# EAGLE design piTC4_v1 (EAGLE 9.6.2)
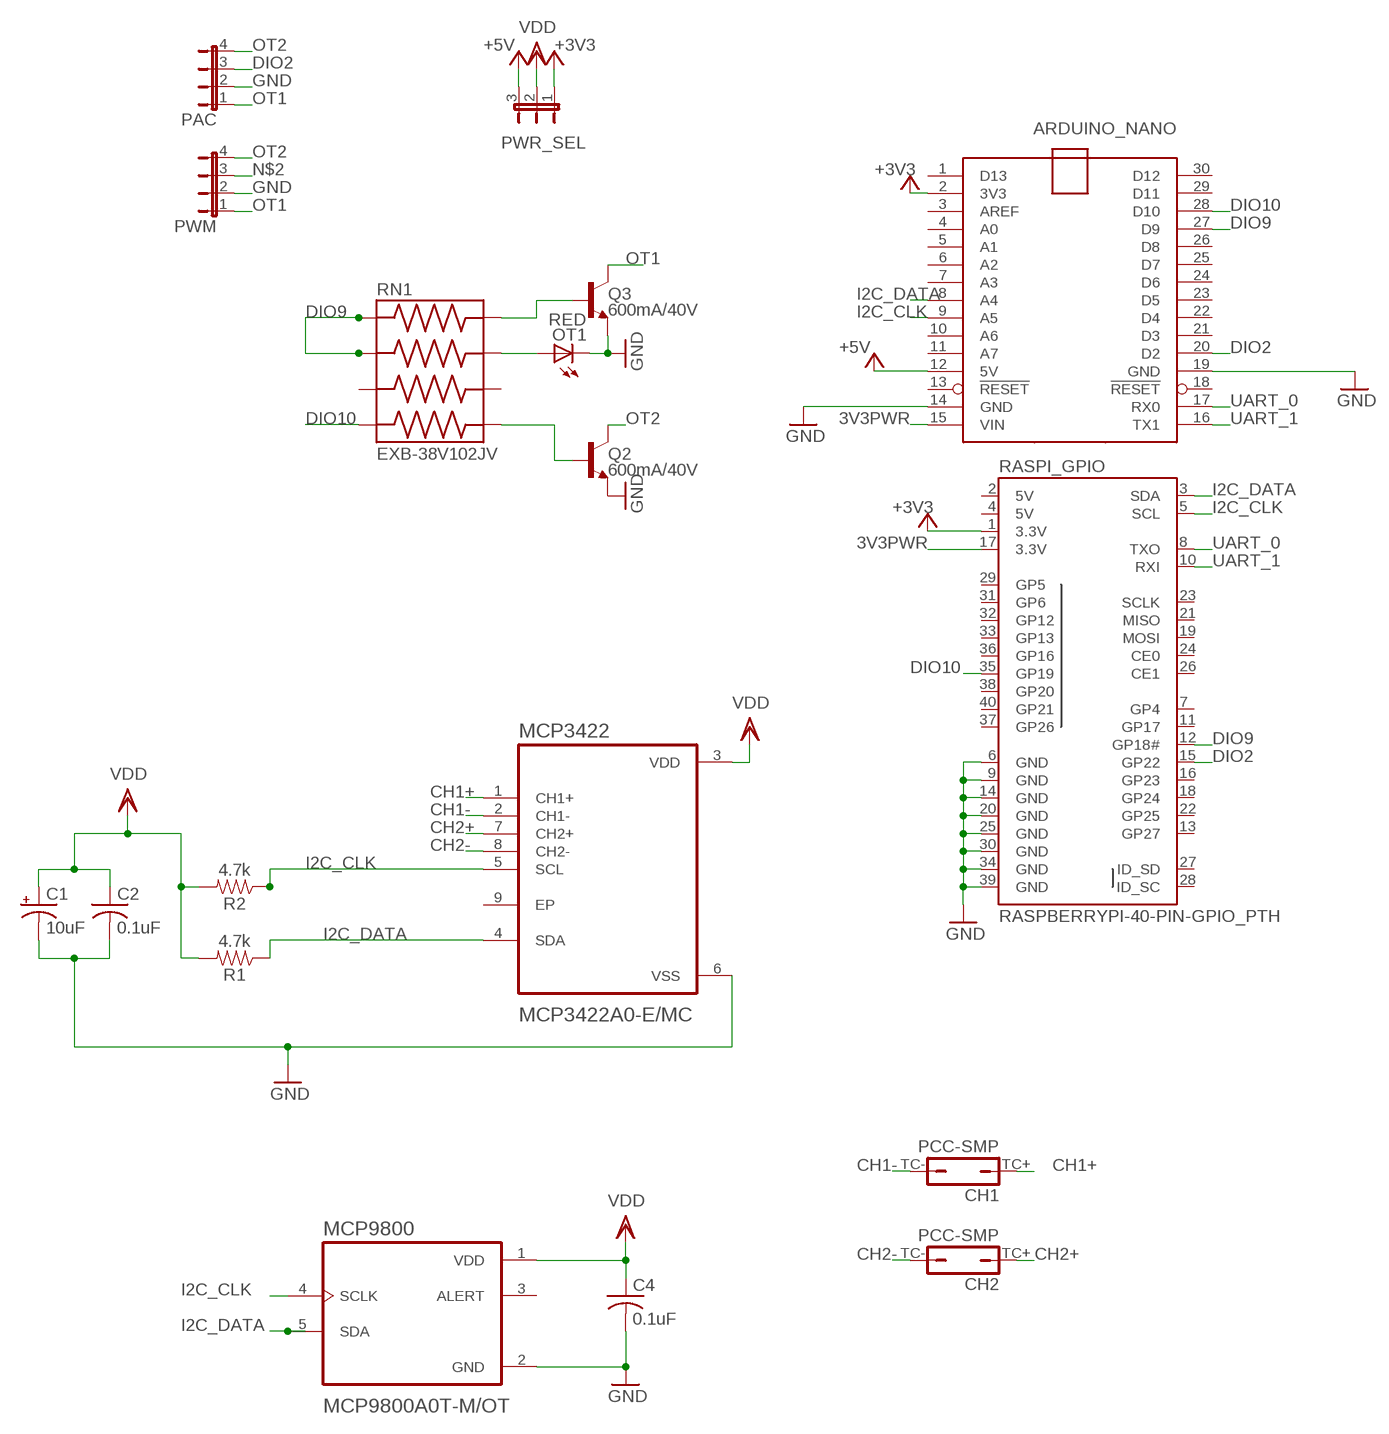
[diagram p0: schematic, sheet 1]

## Parts
ARDUINO_NANO  ARDUINO_NANO  [ARDUINO_NANO]
C1  10uF  10UF-POLAR-EIA3216-16V-10%(TANT)  [EIA3216]
C2  0.1uF  C-USC0805  [C0805]
C4  0.1uF  C-USC0805  [C0805]
CH1  PCC-SMP  [PCC-SMP]
CH2  PCC-SMP  [PCC-SMP]
MCP3422  MCP3422A0-E/MC  [SON50P200X300X100-9N]
MCP9800  MCP9800A0T-M/OT  [SOT95P270X145-5N]
OT1  RED  LEDCHIPLED_0805  [CHIPLED_0805]
PAC  JP4E  [JP4]
PWM  JP4E  [JP4]
PWR_SEL  JP2E  [JP2]
Q2  600mA/40V  TRANS_NPN-MMBT2222AL  [SOT23-3]
Q3  600mA/40V  TRANS_NPN-MMBT2222AL  [SOT23-3]
R1  4.7k  4.7KOHM-0603-1/10W-1%  [0603]
R2  4.7k  4.7KOHM-0603-1/10W-1%  [0603]
RASPI_GPIO  RASPBERRYPI-40-PIN-GPIO_PTH  [2X20_SHROUDED]
RN1  EXB-38V102JV  [RESCAXS80P320X160X60-8N]

## Nets
3V3PWR: ARDUINO_NANO.15(VIN) RASPI_GPIO.17(3.3V)
+3V3: ARDUINO_NANO.2(3V3) PWR_SEL.1 RASPI_GPIO.1(3.3V)
+5V: ARDUINO_NANO.12(5V) PWR_SEL.3
CH1+: CH1.TC+ MCP3422.1(CH1+)
CH1-: CH1.TC- MCP3422.2(CH1-)
CH2+: CH2.TC+ MCP3422.7(CH2+)
CH2-: CH2.TC- MCP3422.8(CH2-)
DIO2: ARDUINO_NANO.20(D2) PAC.3 RASPI_GPIO.15(GP22)
DIO9: ARDUINO_NANO.27(D9) RASPI_GPIO.12(GP18#) RN1.1 RN1.2
DIO10: ARDUINO_NANO.28(D10) RASPI_GPIO.35(GP19) RN1.4
GND: ARDUINO_NANO.14(GND) ARDUINO_NANO.19(GND) C1.- C2.2 C4.2 MCP3422.6(VSS) MCP9800.2(GND) OT1.C PAC.2 PWM.2 Q2.2(E) Q3.2(E) RASPI_GPIO.6(GND) RASPI_GPIO.9(GND) RASPI_GPIO.14(GND) RASPI_GPIO.20(GND) RASPI_GPIO.25(GND) RASPI_GPIO.30(GND) RASPI_GPIO.34(GND) RASPI_GPIO.39(GND)
I2C_CLK: ARDUINO_NANO.9(A5) MCP3422.5(SCL) MCP9800.4(SCLK) R2.1 RASPI_GPIO.5(SCL)
I2C_DATA: ARDUINO_NANO.8(A4) MCP3422.4(SDA) MCP9800.5(SDA) R1.1 RASPI_GPIO.3(SDA)
N$1: Q2.1(B) RN1.5
N$2: PWM.3
N$5: Q3.1(B) RN1.8
N$6: OT1.A RN1.7
OT1: PAC.1 PWM.1 Q3.3(C)
OT2: PAC.4 PWM.4 Q2.3(C)
UART_0: ARDUINO_NANO.17(RX0) RASPI_GPIO.8(TXO)
UART_1: ARDUINO_NANO.16(TX1) RASPI_GPIO.10(RXI)
VDD: C1.+ C2.1 C4.1 MCP3422.3(VDD) MCP9800.1(VDD) PWR_SEL.2 R1.2 R2.2
Unconnected: ARDUINO_NANO.1(D13) ARDUINO_NANO.3(AREF) ARDUINO_NANO.4(A0) ARDUINO_NANO.5(A1) ARDUINO_NANO.6(A2) ARDUINO_NANO.7(A3) ARDUINO_NANO.10(A6) ARDUINO_NANO.11(A7) ARDUINO_NANO.13(!RESET) ARDUINO_NANO.18(!RESET) ARDUINO_NANO.21(D3) ARDUINO_NANO.22(D4) ARDUINO_NANO.23(D5) ARDUINO_NANO.24(D6) ARDUINO_NANO.25(D7) ARDUINO_NANO.26(D8) ARDUINO_NANO.29(D11) ARDUINO_NANO.30(D12) MCP3422.9(EP) MCP9800.3(ALERT) RASPI_GPIO.7(GP4) RASPI_GPIO.11(GP17) RASPI_GPIO.13(GP27) RASPI_GPIO.16(GP23) RASPI_GPIO.18(GP24) RASPI_GPIO.19(MOSI) RASPI_GPIO.21(MISO) RASPI_GPIO.22(GP25) RASPI_GPIO.23(SCLK) RASPI_GPIO.24(CE0) RASPI_GPIO.26(CE1) RASPI_GPIO.27(ID_SD) RASPI_GPIO.28(ID_SC) RASPI_GPIO.29(GP5) RASPI_GPIO.31(GP6) RASPI_GPIO.32(GP12) RASPI_GPIO.33(GP13) RASPI_GPIO.36(GP16) RASPI_GPIO.37(GP26) RASPI_GPIO.38(GP20) RASPI_GPIO.40(GP21) RN1.3 RN1.6

## Power pins joined to a net without a drawn wire
5V: RASPI_GPIO.2(5V) RASPI_GPIO.4(5V)

## Library data of the parts
ARDUINO_NANO = ArduinoNanoV30:ARDUINO_NANO: Arduino Nano V3.0 Overview: The Arduino Nano is a small, complete, and breadboard-friendly board based on the ATmega328 (Arduino Nano 3.x) or ATmega168 (Arduino Nano 2.x). It has more or less the same functionality of the Arduino Duemilanove, but in a different package. It lacks only a DC power jack, and works with a Mini-B USB cable instead of a standard one. The Nano was designed and is being produced by Gravitech. Specifications: Microcontroller Atmel ATmega168 or ATmega328 Operating Voltage (logic level) 5 V Input Voltage (recommended) 7-12 V Input Voltage (limits) 6-20 V Digital I/O Pins 14 (of which 6 provide PWM output) Analog Input Pins 8 DC Current per I/O Pin 40 mA Flash Memory 16 KB (ATmega168) or 32 KB (ATmega328) of which 2 KB used by bootloader SRAM 1 KB (ATmega168) or 2 KB (ATmega328) EEPROM 512 bytes (ATmega168) or 1 KB (ATmega328) Clock Speed 16 MHz Dimensions 0.73" x 1.70" Length 45 mm Width 18 mm Weigth 5 g Power: The Arduino Nano can be powered via the Mini-B USB connection, 6-20V unregulated external power supply (pin 30), or 5V regulated external power supply (pin 27). The power source is automatically selected to the highest voltage source. Memory: The ATmega168 has 16 KB of flash memory for storing code (of which 2 KB is used for the bootloader); the ATmega328 has 32 KB, (also with 2 KB used for the bootloader). The ATmega168 has 1 KB of SRAM and 512 bytes of EEPROM (which can be read and written with the EEPROM library); the ATmega328 has 2 KB of SRAM and 1 KB of EEPROM. Input and Output: Each of the 14 digital pins on the Nano can be used as an input or output, using pinMode(), digitalWrite(), and digitalRead() functions. They operate at 5 volts. Each pin can provide or receive a maximum of 40 mA and has an internal pull-up resistor (disconnected by default) of 20-50 kOhms. In addition, some pins have specialized functions. Visit Arduino - ArduinoBoardNano <https://www.arduino.cc/en/Main/ArduinoBoardNano>
C1 = SparkFun-Capacitors:10UF-POLAR: 10.0µF polarized capacitors A capacitor is a passive two-terminal electrical component used to store electrical energy temporarily in an electric field.; PROD_ID: CAP-00811
C2 C4 = adafruit:C-US: CAPACITOR, American symbol
CH1 CH2 = PCC-SMP:PCC-SMP
MCP3422 = MCP3422A0-E_MC:MCP3422A0-E/MC; DESCRIPTION: 18 Bit Analog to Digital Converter 2 Input 1 Sigma-Delta 8-DFN (2x3); DIGI-KEY_PART_NUMBER: MCP3422A0-E/MC-ND; MF: Microchip; MP: MCP3422A0-E/MC; PACKAGE: DFN-8 Microchip; PURCHASE-URL: https://pricing.snapeda.com/search/part/MCP3422A0-E/MC/?ref=eda
MCP9800 = MCP9800A0T-M_OT:MCP9800A0T-M/OT; DESCRIPTION: Temperature Sensor Digital, Local -55°C ~ 125°C 11 b SOT-23-5; DIGI-KEY_PART_NUMBER: MCP9800A0T-M/OTCT-ND; MF: Microchip; MP: MCP9800A0T-M/OT; PACKAGE: SOT-23-5 Microchip; PURCHASE-URL: https://pricing.snapeda.com/search/part/MCP9800A0T-M/OT/?ref=eda
OT1 = adafruit:LED: LED OSRAM: - CHIPLED LG R971, LG N971, LY N971, LG Q971, LY Q971, LO R971, LY R971 LH N974, LH R974 LS Q976, LO Q976, LY Q976 LO Q996 - Hyper CHIPLED LW Q18S LB Q993, LB Q99A, LB R99A - SideLED LS A670, LO A670, LY A670, LG A670, LP A670 LB A673, LV A673, LT A673, LW A673 LH A674 LY A675 LS A676, LA A676, LO A676, LY A676, LW A676 LS A679, LY A679, LG A679 - Hyper Micro SIDELED® LS Y876, LA Y876, LO Y876, LY Y876 LT Y87S - SmartLED LW L88C, LW L88S LB L89C, LB L89S, LG L890 LS L89K, LO L89K, LY L89K LS L896, LA L896, LO L896, LY L896 - TOPLED LS T670, LO T670, LY T670, LG T670, LP T670 LSG T670, LSP T670, LSY T670, LOP T670, LYG T670 LG T671, LOG T671, LSG T671 LB T673, LV T673, LT T673, LW T673 LH T674 LS T676, LA T676, LO T676, LY T676, LB T676, LH T676, LSB T676, LW T676 LB T67C, LV T67C, LT T67C, LS T67K, LO T67K, LY T67K, LW E67C LS E67B, LA E67B, LO E67B, LY E67B, LB E67C, LV E67C, LT E67C LW T67C LS T679, LY T679, LG T679 LS T770, LO T770, LY T770, LG T770, LP T770 LB T773, LV T773, LT T773, LW T773 LH T774 LS E675, LA E675, LY E675, LS T675 LS T776, LA T776, LO T776, LY T776, LB T776 LHGB T686 LT T68C, LB T68C - Hyper Mini TOPLED® LB M676 - Mini TOPLED Santana® LG M470 LS M47K, LO M47K, LY M47K Source: http://www.osram.convergy.de/
PAC PWM = jumper-piTC2:JP4E: JUMPER
PWR_SEL = jumper-piTC:JP2E: JUMPER
Q2 Q3 = SparkFun-DiscreteSemi:TRANS_NPN: NPN transistor Current controlled devices typically used to amplify current or used as a switch. BC547 - COM-08928 <http://www.sparkfun.com/products/8928> (TO-92 45V 100mA) (1.Collector 2.Base 3.Emitter) 2N3904 - COM-00521 <http://www.sparkfun.com/products/521> (TO-92 40V 200mA) (1.Emitter 2.Base 3.Collector) P2N2222A - COM-12852 <http://www.sparkfun.com/products/12852> (TO-92 40V 600mA) (1.Collector 2.Base 3.Emitter); PROD_ID: TRANS-08049
R1 R2 = SparkFun-Resistors:4.7KOHM: 4.7kΩ resistor A resistor is a passive two-terminal electrical component that implements electrical resistance as a circuit element. Resistors act to reduce current flow, and, at the same time, act to lower voltage levels within circuits. - Wikipedia; PROD_ID: RES-07857
RASPI_GPIO = SparkFun-Connectors:RASPBERRYPI-40-PIN-GPIO: Raspberry Pi GPIO Header 2x20 pin connector, as found on B, B+, A+ models. Both shrouded PTH and SMT versions available. SparkFun Products: GPIO Shrouded Header <https://www.sparkfun.com/products/13054>- PTH SparkFun Pi Wedge (Preassembled) <https://www.sparkfun.com/products/13717>; PROD_ID: CONN-12263; SF_ID: PRT-13054
RN1 = EXB-38V102JV:EXB-38V102JV: Res Thick Film Array 470 Ohm 5% ?200ppm/C ISOL Molded 8-Pin 1206(4 X 0603) Convex SMD Automotive T/R; DESCRIPTION: 1k Ohm ±5% 62.5mW Power Per Element Isolated Resistor Network/Array ±200ppm/°C 1206 (3216 Metric), Convex, Long Side Terminals; DIGI-KEY_PART_NUMBER: Y9102CT-ND; MF: Panasonic; MP: EXB-38V102JV; PACKAGE: 1206 Panasonic; PURCHASE-URL: https://pricing.snapeda.com/search/part/EXB-38V102JV/?ref=eda

## Net classes
0 default: width 0.305 mm, drill 0.127 mm, clearance 0.203 mm
1 DC: width 0.61 mm, drill 0.254 mm, clearance 0.406 mm
2 AC: width 5.08 mm, drill 0.305 mm, clearance 5.08 mm
3 Hole: drill 2.05 mm, clearance 4.8 mm

## Board
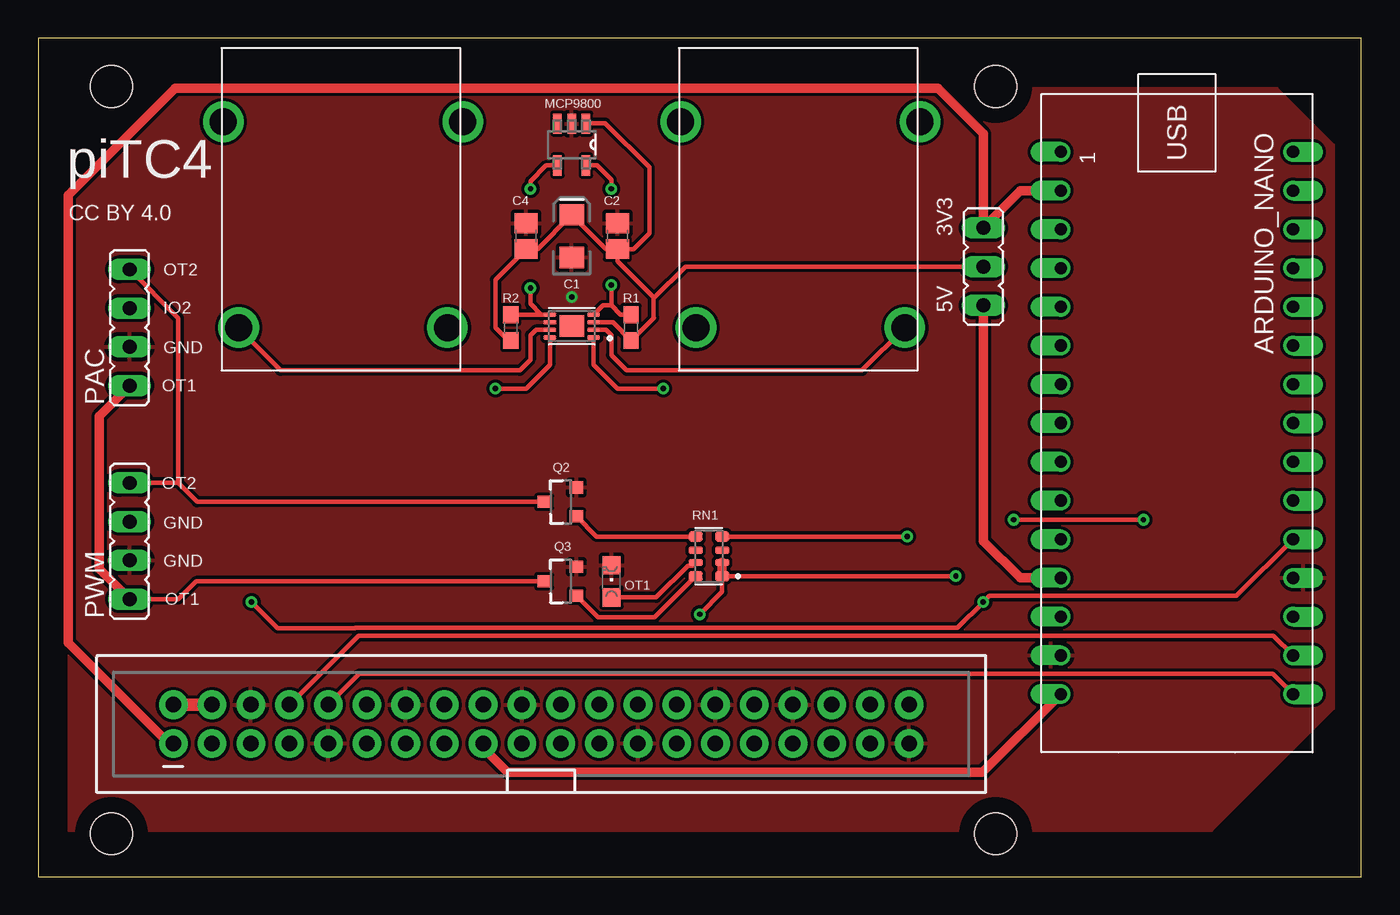
[diagram p1: board, top side]
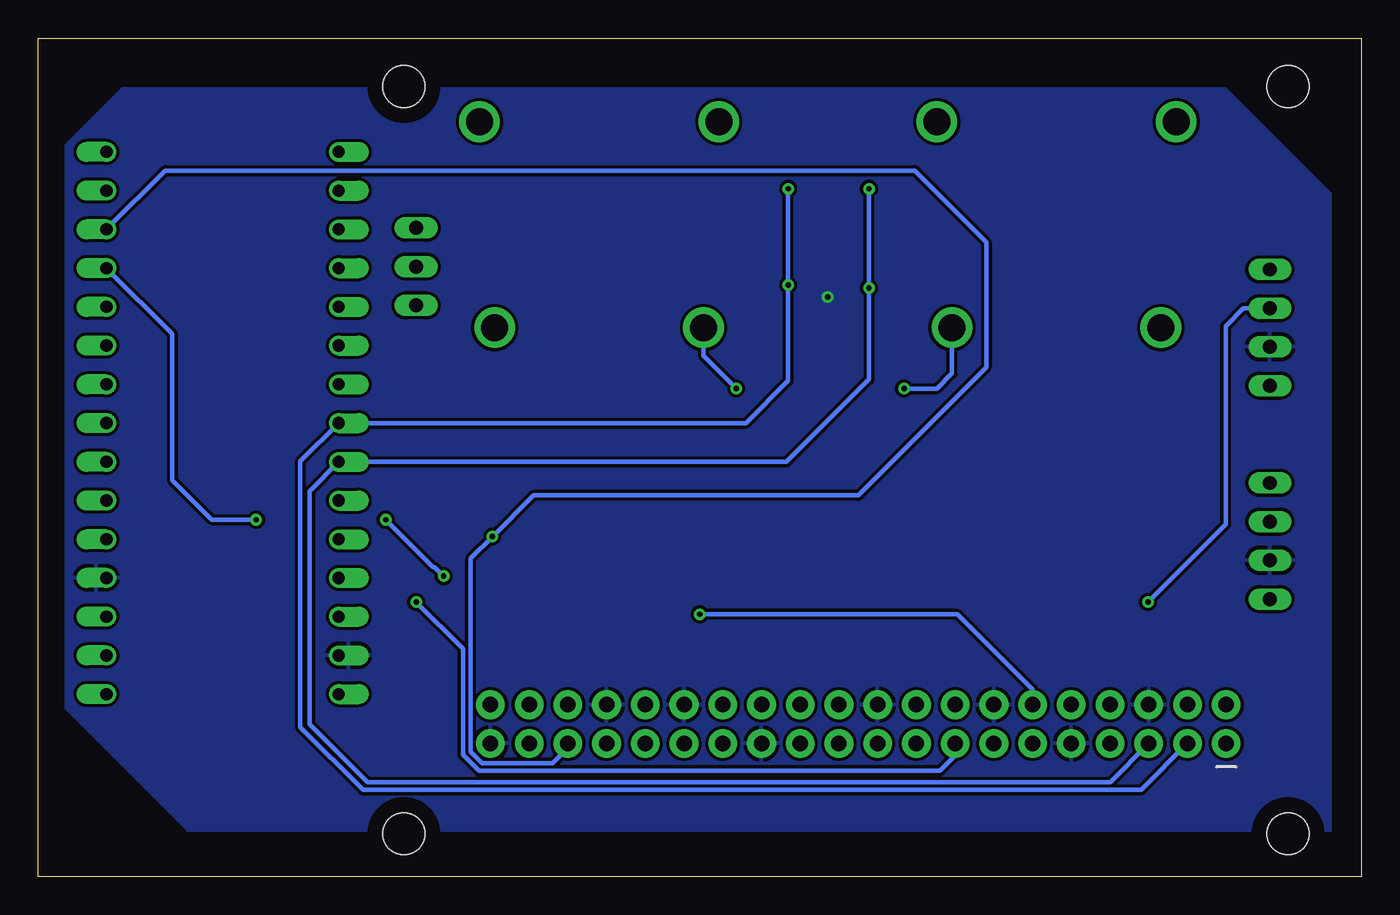
[diagram p2: board, bottom side, seen from below]

Size 86.8 x 54.98 mm. Coordinates in mm from the lower left corner, seen from the top.
Outline: 0,0 86.8,0 86.8,54.98 0,54.98 0,0
Copper layers (1*16): Top 0.035mm / dielectric 1.5mm / Bottom 0.035mm
Design rules "default": minimum track width 6mil, minimum drill 0.35mm, track to track 6mil, track to pad 6mil, pad to pad 6mil, via to via 6mil, smd to smd 6mil, copper to edge 40mil, drill to drill 6mil, minimum pad ring 10mil, minimum via ring 8mil, stop-mask expansion 4mil, vias tented up to drill 0mil, thermal gap 10mil
Holes 2.75 mm at 4.81,2.81 4.81,51.81 62.81,2.81 62.81,51.81

### Footprints (pad centres in the part's own frame; a part is rotated, then mirrored left to right if it is on the bottom)
ARDUINO_NANO = drill 0.8 offset: 1 -20.32,-7.62; 2 -17.78,-7.62; 3 -15.24,-7.62; 4 -12.7,-7.62; 5 -10.16,-7.62; 6 -7.62,-7.62; 7 -5.08,-7.62; 8 -2.54,-7.62; 9 0,-7.62; 10 2.54,-7.62; 11 5.08,-7.62; 12 7.62,-7.62; 13 10.16,-7.62; 14 12.7,-7.62; 15 15.24,-7.62; 16 15.24,7.62; 17 12.7,7.62; 18 10.16,7.62; 19 7.62,7.62; 20 5.08,7.62; 21 2.54,7.62; 22 0,7.62; 23 -2.54,7.62; 24 -5.08,7.62; 25 -7.62,7.62; 26 -10.16,7.62; 27 -12.7,7.62; 28 -15.24,7.62; 29 -17.78,7.62; 30 -20.32,7.62
EIA3216 = smd 1.4 x 1.6: + 1.4,0; - -1.4,0
C0805 = smd 1.3 x 1.5: 1 -0.85,0; 2 0.85,0
PCC-SMP = drill 1.778: CLIP0 7.85,13.5; CLIP1 -7.85,13.5; TC+ -6.85,0; TC- 6.85,0
SON50P200X300X100-9N = smd 0.84 x 0.27: 1 -1.435,0.75; 2 -1.435,0.25; 3 -1.435,-0.25; 4 -1.435,-0.75; 5 1.435,-0.75; 6 1.435,-0.25; 7 1.435,0.25; 8 1.435,0.75 | smd 1.625 x 1.425: 9 0,0
SOT95P270X145-5N = smd 1.321 x 0.559: 1 -1.372,0.94; 2 -1.372,0; 3 -1.372,-0.94; 4 1.372,-0.94; 5 1.372,0.94
CHIPLED_0805 = smd 1.2 x 1.2: A 0,-1.05; C 0,1.05
JP4 = drill 0.914 long: 1 -3.81,0; 2 -1.27,0; 3 1.27,0; 4 3.81,0
JP2 = drill 0.914 long: 1 -2.54,0; 2 0,0; 3 2.54,0
SOT23-3 = smd 0.8 x 0.9: 1 -0.95,-1; 2 0.95,-1; 3 0,1.1
0603 = smd 1.1 x 1: 1 -0.85,0; 2 0.85,0
2X20_SHROUDED = drill 1.016 pad 1.88: 1 -1.27,24.13; 2 1.27,24.13; 3 -1.27,21.59; 4 1.27,21.59; 5 -1.27,19.05; 6 1.27,19.05; 7 -1.27,16.51; 8 1.27,16.51; 9 -1.27,13.97; 10 1.27,13.97; 11 -1.27,11.43; 12 1.27,11.43; 13 -1.27,8.89; 14 1.27,8.89; 15 -1.27,6.35; 16 1.27,6.35; 17 -1.27,3.81; 18 1.27,3.81; 19 -1.27,1.27; 20 1.27,1.27; 21 -1.27,-1.27; 22 1.27,-1.27; 23 -1.27,-3.81; 24 1.27,-3.81; 25 -1.27,-6.35; 26 1.27,-6.35; 27 -1.27,-8.89; 28 1.27,-8.89; 29 -1.27,-11.43; 30 1.27,-11.43; 31 -1.27,-13.97; 32 1.27,-13.97; 33 -1.27,-16.51; 34 1.27,-16.51; 35 -1.27,-19.05; 36 1.27,-19.05; 37 -1.27,-21.59; 38 1.27,-21.59; 39 -1.27,-24.13; 40 1.27,-24.13
RESCAXS80P320X160X60-8N = smd 0.93 x 0.68: 1 -0.87,1.3; 4 -0.87,-1.3; 5 0.87,-1.3; 8 0.87,1.3 | smd 0.93 x 0.48: 2 -0.87,0.4; 3 -0.87,-0.4; 6 0.87,-0.4; 7 0.87,0.4

### Placement (x,y rotation side)
ARDUINO_NANO  74.7,27.2 270 top
C1  35,42 90 top
C2  38,42 90 top
C4  32,42 90 top
CH1  50,36 0 top
CH2  20,36 0 top
MCP3422  35,36.1 180 top
MCP9800  35,48 270 top
OT1  37.61,19.36 0 top
PAC  6,36 90 top
PWM  6,22 90 top
PWR_SEL  62,40 270 top
Q2  34.31,24.57 90 top
Q3  34.31,19.36 90 top
R1  38.9,36 270 top
R2  31,36 270 top
RASPI_GPIO  33,10 90 top
RN1  44,21 180 top

### Tracks (layer width: path | path; a pad name or v marks a point on that pad's centre or on a via)
3V3PWR
  Top 0.61: RASPI_GPIO.17 29.19,8.44 30.79,6.83 61.95,6.83 ARDUINO_NANO.15
5V
  Top 0.813: RASPI_GPIO.2 RASPI_GPIO.4
+3V3
  Top 0.305: RASPI_GPIO.1 8.58,8.73
  Top 0.61: ARDUINO_NANO.2 64.44,44.98 PWR_SEL.1 62,48.7 59.01,51.69 8.99,51.69 1.98,44.67 1.98,15.33 8.58,8.73
+5V
  Top 0.61: ARDUINO_NANO.12 64.42,19.58 62,22 PWR_SEL.3
CH1+  (via drill 0.35)
  Top 0.305: MCP3422.1 36.44,33.56 38,32 v41,32
  Bottom 0.305: v41,32 43.15,34.15 CH1.TC+
CH1-
  Top 0.305: MCP3422.2 37.25,35.85 37.6,35.5 37.6,34.2 38.6,33.2 54.05,33.2 CH1.TC-
CH2+
  Top 0.305: MCP3422.7 32.65,35.85 32.3,35.5 32.3,33.9 31.6,33.2 15.9,33.2 13.15,35.95 CH2.TC+
CH2-  (via drill 0.35)
  Top 0.305: MCP3422.8 33.56,33.56 32,32 v30,32
  Bottom 0.305: v30,32 27.85,32 26.85,33 CH2.TC-
DIO2  (via drill 0.35)
  Top 0.305: ARDUINO_NANO.20 78.6,18.4 62.4,18.4 v62,18 60.31,16.31 20.81,16.31 20.8,16.3 15.7,16.3 v14,18
  Bottom 0.305: v62,18 58.93,14.93 58.93,7.98 57.88,6.93 27.66,6.93 26.65,7.94 RASPI_GPIO.15 | v14,18 8.9,23.1 8.9,36.1 7.73,37.27 PAC.3
DIO9  (via drill 0.35)
  Top 0.305: v43.4,17.2 44.87,18.67 RN1.1 v60.2,19.7 | v72.5,23.4 v64,23.4
  Top 0.61: RN1.2 RN1.1
  Bottom 0.305: RASPI_GPIO.12 21.57,12.27 26.5,17.2 v43.4,17.2 | ARDUINO_NANO.27 78,35.58 78,26 75.4,23.4 v72.5,23.4 | v64,23.4 60.9,20.3 60.8,20.3 v60.2,19.7
DIO10  (via drill 0.35)
  Top 0.305: v57,22.3 RN1.4
  Bottom 0.305: RASPI_GPIO.35 52.05,8.44 53.05,7.43 57.67,7.43 58.42,8.19 58.42,20.88 v57,22.3 54.3,25 33,25 24.6,33.4 24.6,41.6 29.3,46.3 78.46,46.3 ARDUINO_NANO.28
GND  (via drill 0.35)
  other vias: 35,38
  pour Top: 2,3 77,3 85,11 85,48 81.3,51.7 8.9,51.7 2,44.8
  pour Bottom: 2,3 77,3 85,11 85,48 81.3,51.7 8.9,51.7 2,44.8
I2C_CLK  (via drill 0.35)
  Top 0.305: MCP3422.5 33,36.85 | 33,36.85 R2.1 | v32.3,38.6 32.3,37.55 33,36.85 | v32.3,45.1 32.3,45.6 33.33,46.63 MCP9800.4
  Bottom 0.305: v32.3,45.1 v32.3,38.6 32.3,32.6 37.7,27.2 ARDUINO_NANO.9 69,25.28 69,10 65.2,6.2 16.48,6.2 RASPI_GPIO.5
I2C_DATA  (via drill 0.35)
  Top 0.305: v37.6,45.1 37.6,45.7 36.67,46.63 MCP9800.5 | v37.6,38.8 37.6,37.46 | MCP3422.4 37.04,37.46 37.6,37.46 | 37.6,37.46 38.21,36.85 R1.1
  Bottom 0.305: v37.6,45.1 v37.6,38.8 37.6,32.5 40.36,29.74 ARDUINO_NANO.8 69.6,27.22 69.6,9.8 65.49,5.69 14.45,5.69 RASPI_GPIO.3
N$1
  Top 0.305: RN1.5 36.63,22.3 Q2.1
N$5
  Top 0.305: RN1.8 40.43,17 36.72,17 Q3.1
N$6
  Top 0.305: RN1.7 42.93,20.4 42.62,20.4 40.53,18.31 OT1.A
OT1
  Top 0.305: Q3.3 10.36,19.36 9.19,18.19 PWM.1
  Top 0.61: PAC.1 4,30.19 4,20.19 PWM.1
OT2
  Top 0.305: Q2.3 10.43,24.57 9.19,25.81 | 9.19,25.81 9.19,36.62 PAC.4 | 9.19,25.81 PWM.4
UART_0
  Top 0.305: RASPI_GPIO.8 21.02,15.8 81.02,15.8 ARDUINO_NANO.17
UART_1
  Top 0.305: RASPI_GPIO.10 21.06,13.3 80.98,13.3 ARDUINO_NANO.16
VDD
  Top 0.305: C2.1 37.25,41.15 C1.+ 32.75,41.15 C4.1 30,39.15 30,36 30.85,35.15 R2.2 | MCP3422.3 37.7,36.35 R1.2 40.38,36.62 | C2.1 38,40.35 40.4,37.95 | 40.4,36.65 40.38,36.62 | C2.1 39.05,41.15 40.1,42.2 40.1,46.5 37.2,49.4 35.97,49.4 MCP9800.1 | 40.4,37.95 42.45,40 PWR_SEL.2 | 40.38,36.62 40.38,37.92 40.4,37.95

### Text on the board
tNames: piTC4 | CC BY 4.0 | OT2 | IO2 | GND | OT1 | OT2 | GND | GND | OT1
_tNames: 3V3 | 5V